# EAGLE design CommsTestBoard (EAGLE 9.6.2)
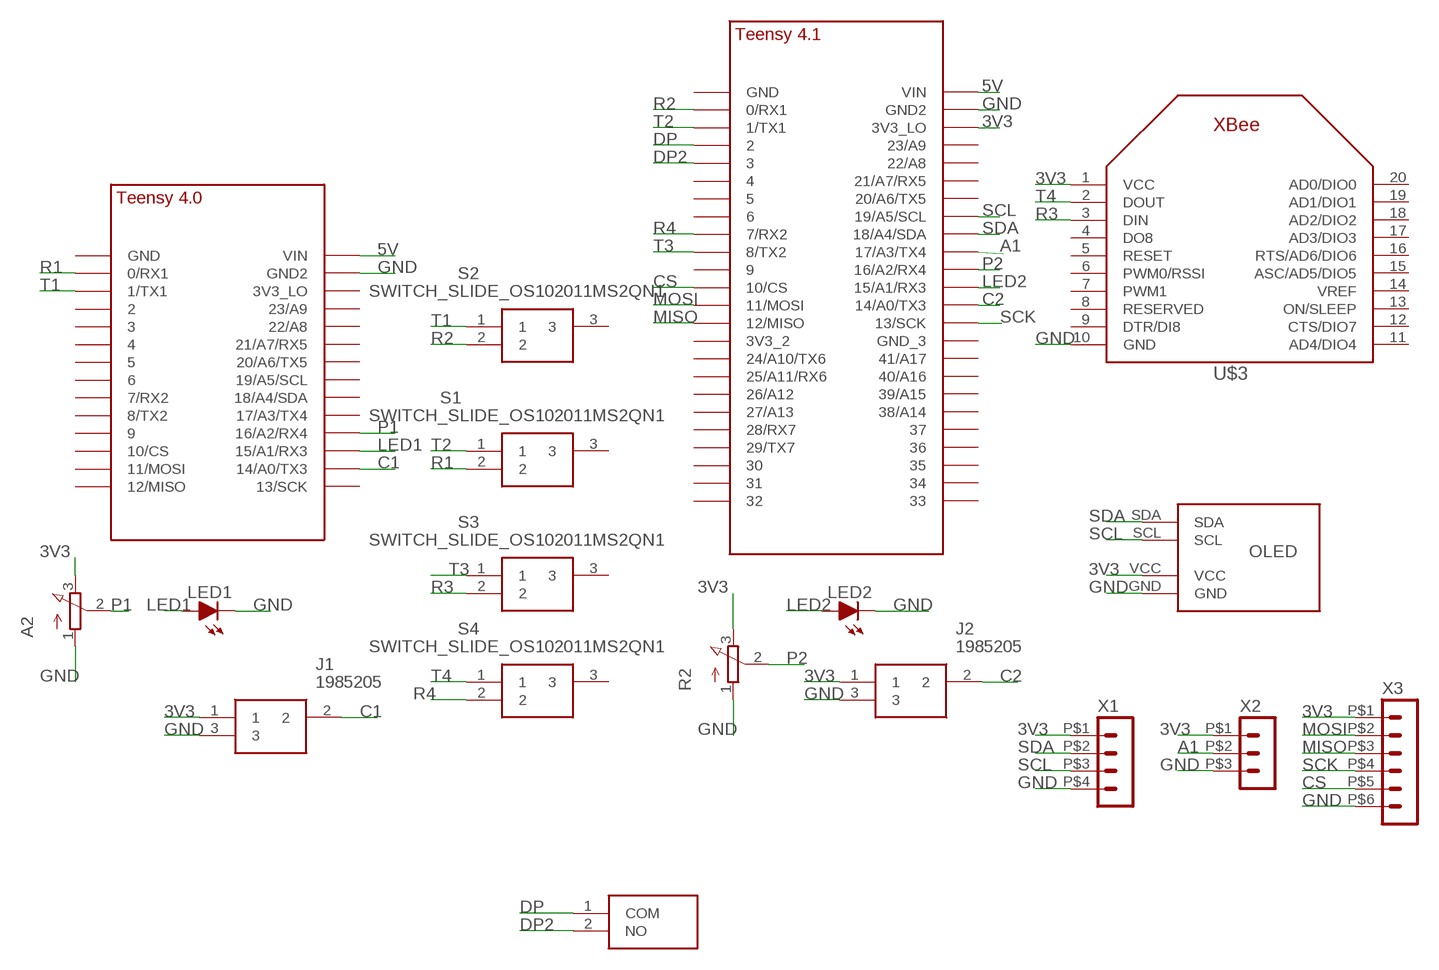
[diagram p0: schematic, sheet 1]

## Parts
A2  POTENTIOMETER  [3RP/1610N]
J1  1985205  [1985205]
J2  1985205  [1985205]
LED1  LED-5MM  [LED-5MM]
LED2  LED-5MM  [LED-5MM]
R2  POTENTIOMETER  [3RP/1610N]
S1  SWITCH_SLIDE_OS102011MS2QN1  [OS102011MA1QN1]
S2  SWITCH_SLIDE_OS102011MS2QN1  [OS102011MA1QN1]
S3  SWITCH_SLIDE_OS102011MS2QN1  [OS102011MA1QN1]
S4  SWITCH_SLIDE_OS102011MS2QN1  [OS102011MA1QN1]
S5  PTS636_SL50_LFS  [PTS636SL50LFS]
U$1  TEENSY_4.0_SIMPLE  [TEENSY_4.0_SIMPLE]
U$2  TEENSY_4.1_SIMPLE  [TEENSY_4.1_SIMPLE]
U$3  XBEE  [XBEE]
U$4  OLED_SSD1306  [OLED_SSD1306]
X1  HEADER_POS4_43045-0401  [43045-0400]
X2  HEADER_POS3_43650-0300  [43650-0300]
X3  HEADER_POS6_43045-0600  [43045-0600]

## Nets
3V3: A2.3(E) J1.1 J2.1 R2.3(E) U$2.3V3_LO U$3.1(VCC) U$4.VCC X1.P$1 X2.P$1 X3.P$1
5V: U$1.VIN U$2.VIN
A1: U$2.17/A3(17/A3/TX4) X2.P$2
C1: J1.2 U$1.14/A0(14/A0/TX3)
C2: J2.2 U$2.14/A0(14/A0/TX3)
CS: U$2.10/CS X3.P$5
DP: S5.1(COM) U$2.2
DP2: S5.2(NO) U$2.3/CANTX
GND: A2.1(A) J1.3 J2.3 LED1.K(C) LED2.K(C) R2.1(A) U$1.GND2 U$2.GND2 U$3.10(GND) U$4.GND X1.P$4 X2.P$3 X3.P$6
LED1: LED1.A U$1.15/A1(15/A1/RX3)
LED2: LED2.A U$2.15/A1(15/A1/RX3)
MISO: U$2.12/MISO X3.P$3
MOSI: U$2.11/MOSI X3.P$2
P1: A2.2(S) U$1.16/A2(16/A2/RX4)
P2: R2.2(S) U$2.16/A2(16/A2/RX4)
R1: S1.2 U$1.0/RX(0/RX1)
R2: S2.2 U$2.0/RX(0/RX1)
R3: S3.2 U$3.3(DIN)
R4: S4.2 U$2.7(7/RX2)
SCK: U$2.13/SCK X3.P$4
SCL: U$2.19/A5/SCL U$4.SCL X1.P$3
SDA: U$2.18/A4/SDA U$4.SDA X1.P$2
T1: S2.1 U$1.1/TX(1/TX1)
T2: S1.1 U$2.1/TX(1/TX1)
T3: S3.1 U$2.8(8/TX2)
T4: S4.1 U$3.2(DOUT)
Unconnected: S1.3 S2.3 S3.3 S4.3 U$1.2 U$1.3/CANTX U$1.3V3_LO U$1.4/CANRX U$1.5 U$1.6 U$1.7(7/RX2) U$1.8(8/TX2) U$1.9/CS U$1.10/CS U$1.11/MOSI U$1.12/MISO U$1.13/SCK U$1.17/A3(17/A3/TX4) U$1.18/A4/SDA U$1.19/A5/SCL U$1.20/A6(20/A6/TX5) U$1.21/A7(21/A7/RX5) U$1.22/A8 U$1.23/A9 U$1.GND U$2.3V3_2 U$2.4/CANRX U$2.5 U$2.6 U$2.9/CS U$2.20/A6(20/A6/TX5) U$2.21/A7(21/A7/RX5) U$2.22/A8 U$2.23/A9 U$2.24/A10(24/A10/TX6) U$2.25/A11(25/A11/RX6) U$2.26/A12 U$2.27/A13 U$2.28(28/RX7) U$2.29(29/TX7) U$2.30 U$2.31 U$2.32 U$2.33 U$2.34 U$2.35 U$2.36 U$2.37 U$2.38/A14 U$2.39/A15 U$2.40/A16 U$2.41/A17 U$2.GND U$2.GND3(GND_3) U$3.4(DO8) U$3.5(RESET) U$3.6(PWM0/RSSI) U$3.7(PWM1) U$3.8(RESERVED) U$3.9(DTR/DI8) U$3.11(AD4/DIO4) U$3.12(CTS/DIO7) U$3.13(ON/SLEEP) U$3.14(VREF) U$3.15(ASC/AD5/DIO5) U$3.16(RTS/AD6/DIO6) U$3.17(AD3/DIO3) U$3.18(AD2/DIO2) U$3.19(AD1/DIO1) U$3.20(AD0/DIO0)

## Library data of the parts
A2 R2 = GTOR - Passive Components:POTENTIOMETER: 16mm Potentiometer one level Source: http://www.alphapotentiometers.net/html/16mm_pot_2.html
J1 J2 = GTOR - Connectors:1985205: Fixed Terminal Blocks PTSA 1.5/3-3.5-Z Source: Datasheet <https://componentsearchengine.com/Datasheets/1/1985205.pdf>; ARROW_PART_NUMBER: 1985205; ARROW_PRICE-STOCK: https://www.arrow.com/en/products/1985205/phoenix-contact; DESCRIPTION: Fixed Terminal Blocks PTSA 1.5/3-3.5-Z; HEIGHT: 13mm; MANUFACTURER_NAME: Phoenix Contact; MANUFACTURER_PART_NUMBER: 1985205; MOUSER_PART_NUMBER: 651-1985205; MOUSER_PRICE-STOCK: https://www.mouser.co.uk/ProductDetail/Phoenix-Contact/1985205?qs=JcjeNNoqGSNoFnucoMlHJQ%3D%3D
LED1 LED2 = GTOR - Passive Components:LED: Light Emitting Diode (LED) Source: Dangerous Prototypes Eagle Library <https://github.com/DangerousPrototypes/Eagle_Part_Library>
S1-S4 = GTOR - Active Components:SWITCH_SLIDE_OS102011MS2QN1: Switch Slide Miniature SPDT 0.1A 12VDC Through Hole Slide Switch SPDT On-On 0.1 A@ 12 V dc Slide Source: Datasheet <http://www.ckswitches.com/media/1428/os.pdf>; ARROW_PART_NUMBER: OS102011MS2QN1; ARROW_PRICE-STOCK: https://www.arrow.com/en/products/os102011ms2qn1/ck; DESCRIPTION: Switch Slide Miniature SPDT 0.1A 12VDC Through Hole Slide Switch SPDT On-On 0.1 A@ 12 V dc Slide; HEIGHT: mm; MANUFACTURER_NAME: C & K COMPONENTS; MANUFACTURER_PART_NUMBER: OS102011MS2QN1; MOUSER_PART_NUMBER: 611-OS102011MS2QN1; MOUSER_PRICE-STOCK: https://www.mouser.co.uk/ProductDetail/CK/OS102011MS2QN1?qs=WtljUlYws5RvQ1hEv876nQ%3D%3D
S5 = GTOR - Active Components:PTS636_SL50_LFS: Tactile Switches Tact 50mA 12VDC, 6.0x3.5, 5.0mm H, 130gf, THT leads, Black Actuator Source: Datasheet <https://componentsearchengine.com/Datasheets/1/PTS636 SL50 LFS.pdf>; ARROW_PART_NUMBER: PTS636 SL50 LFS; ARROW_PRICE-STOCK: https://www.arrow.com/en/products/pts636-sl50-lfs/ck; DESCRIPTION: Tactile Switches Tact 50mA 12VDC, 6.0x3.5, 5.0mm H, 130gf, THT leads, Black Actuator; HEIGHT: 5.2mm; MANUFACTURER_NAME: C & K COMPONENTS; MANUFACTURER_PART_NUMBER: PTS636 SL50 LFS; MOUSER_PART_NUMBER: 611-PTS636SL50LFS; MOUSER_PRICE-STOCK: https://www.mouser.co.uk/ProductDetail/CK/PTS636-SL50-LFS?qs=vLWxofP3U2xbACAJDYC1Hw%3D%3D
U$1 = GTOR - Microcontroller:TEENSY_4.0_SIMPLE
U$2 = GTOR - Microcontroller:TEENSY_4.1_SIMPLE
U$3 = GTOR - Microcontroller:XBEE: Source: Adafruit <https://github.com/adafruit/Adafruit-Eagle-Library>
U$4 = GTOR - Breakout Boards:OLED_SSD1306
X1 = GTOR - Microfit Connector:HEADER_POS4_?: Molex - Micro-Fit 3.0 Series connector, 3.00mm (0.118") pitch header, 4 positions.
X2 = GTOR - Microfit Connector:HEADER_POS3_?: Molex - Micro-Fit 3.0 Series connector, 3.00mm (0.118") pitch header, 3 positions.
X3 = GTOR - Microfit Connector:HEADER_POS6_?: Molex - Micro-Fit 3.0 Series connector, 3.00mm (0.118") pitch header, 6 positions.

## Board
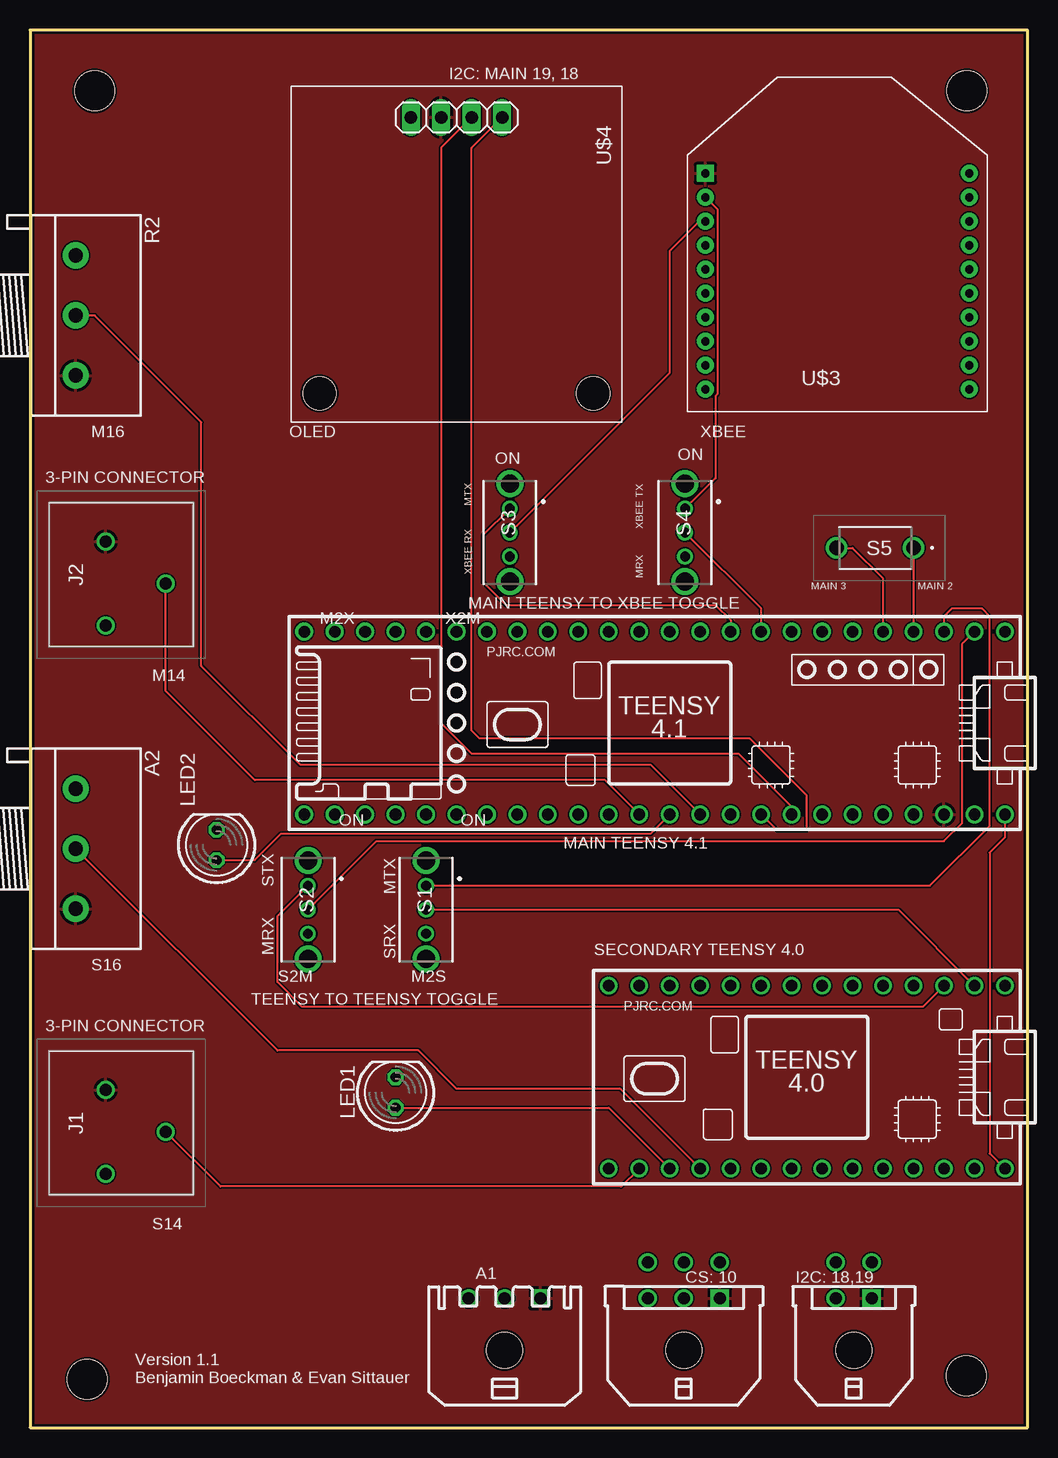
[diagram p1: board, top side]
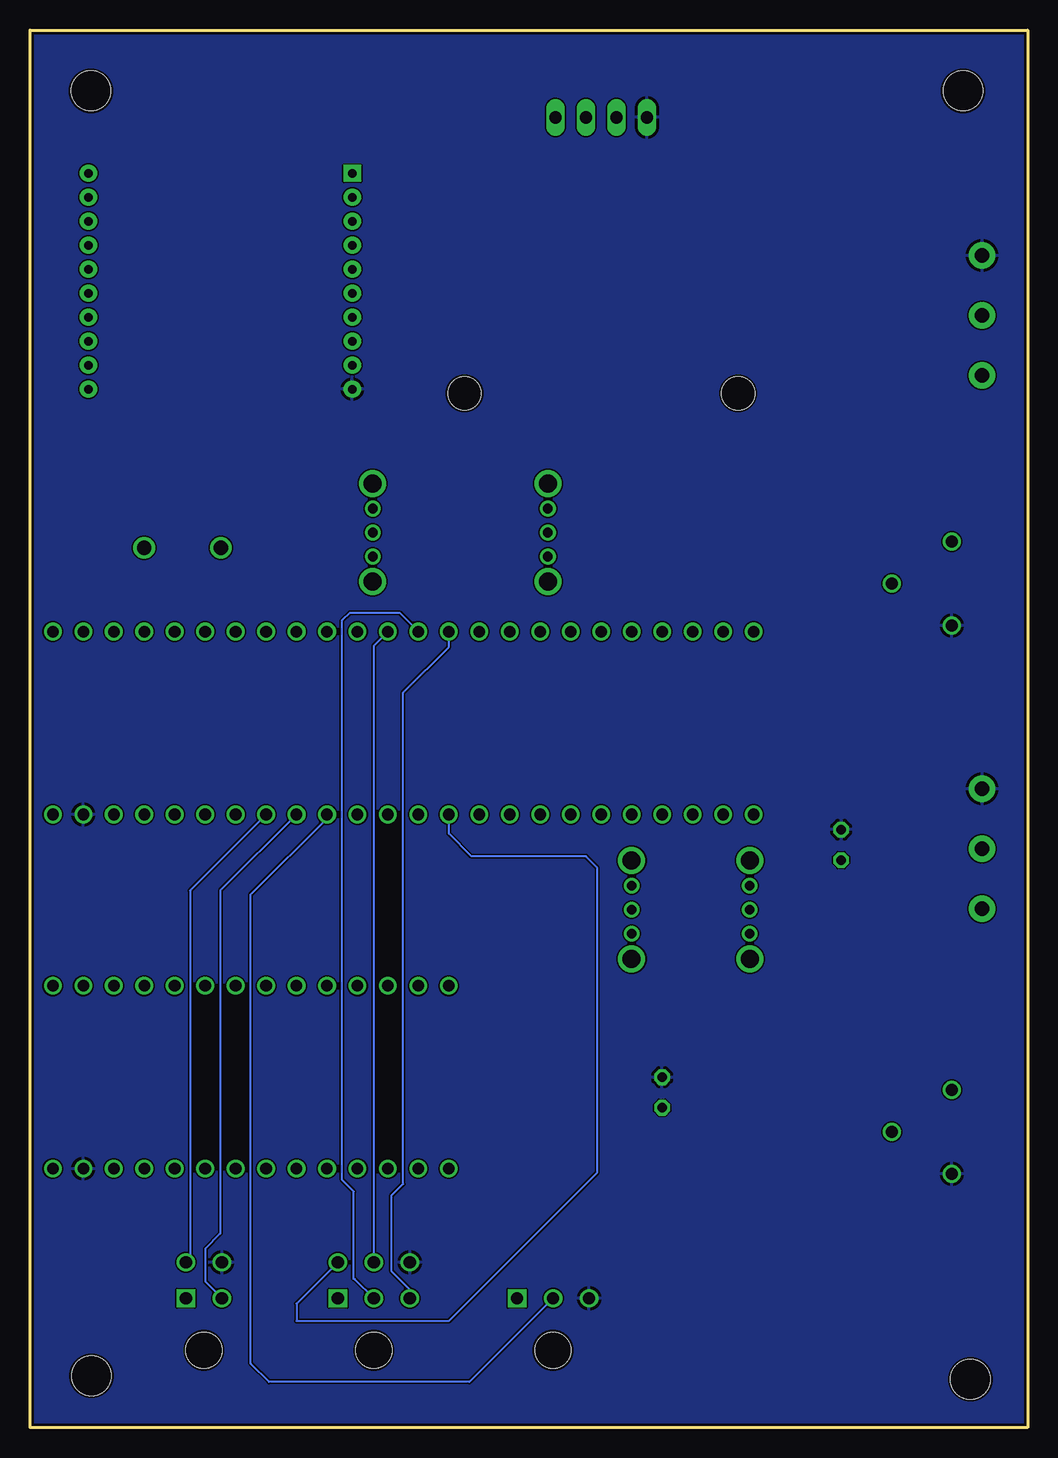
[diagram p2: board, bottom side, seen from below]

Size 83.18 x 116.51 mm. Coordinates in mm from the lower left corner, seen from the top.
Outline: 83.18,0 83.18,116.51 0,116.51 0,0 83.18,0
Copper layers (1*16): Top 0.035mm / dielectric 1.6mm / Bottom 0.035mm
Design rules "designrulecheck_jlcpcb_2layers": minimum track width 5mil, minimum drill 0.3mm, track to track 5mil, track to pad 0.2mm, pad to pad 5mil, via to via 10mil, smd to smd 5mil, copper to edge 0.2mm, drill to drill 0.5mm, minimum pad ring 10mil, minimum via ring 0.3mm, stop-mask expansion 4mil, vias tented up to drill 0mil, thermal gap 10mil
Holes 3.3 mm at 4.78,4.03 5.4,111.44 78.1,111.44 78.05,4.32
Holes 2.75 mm at 24.15,86.21 46.95,86.21

### Footprints (pad centres in the part's own frame; a part is rotated, then mirrored left to right if it is on the bottom)
3RP/1610N = drill 1.2 pad 2.184: 1 -5,0; 2 0,0; 3 5,0
1985205 = drill 1 pad 1.5: 1 -2.75,-1.3; 2 0.75,3.7; 3 4.25,-1.3
LED-5MM = drill 0.813 octagon: A -1.27,0; K 1.27,0
OS102011MA1QN1 = drill 0.8 pad 1.3: 1 -2,0; 2 0,0; 3 2,0 | drill 1.5 pad 2.25: 4 -4.1,0; 5 4.1,0
PTS636SL50LFS = drill 1.2 pad 1.8: 1 0,0; 2 6.4,0
TEENSY_4.0_SIMPLE = drill 0.965: 0/RX -13.97,-7.62; 1/TX -11.43,-7.62; 2 -8.89,-7.62; 3/CANTX -6.35,-7.62; 3V3_LO -11.43,7.62; 4/CANRX -3.81,-7.62; 5 -1.27,-7.62; 6 1.27,-7.62; 7 3.81,-7.62; 8 6.35,-7.62; 9/CS 8.89,-7.62; 10/CS 11.43,-7.62; 11/MOSI 13.97,-7.62; 12/MISO 16.51,-7.62; 13/SCK 16.51,7.62; 14/A0 13.97,7.62; 15/A1 11.43,7.62; 16/A2 8.89,7.62; 17/A3 6.35,7.62; 18/A4/SDA 3.81,7.62; 19/A5/SCL 1.27,7.62; 20/A6 -1.27,7.62; 21/A7 -3.81,7.62; 22/A8 -6.35,7.62; 23/A9 -8.89,7.62; GND -16.51,-7.62; GND2 -13.97,7.62; VIN -16.51,7.62
TEENSY_4.1_SIMPLE = drill 0.965: 0/RX -25.4,-7.62; 1/TX -22.86,-7.62; 2 -20.32,-7.62; 3/CANTX -17.78,-7.62; 3V3_2 7.62,-7.62; 3V3_LO -22.86,7.62; 4/CANRX -15.24,-7.62; 5 -12.7,-7.62; 6 -10.16,-7.62; 7 -7.62,-7.62; 8 -5.08,-7.62; 9/CS -2.54,-7.62; 10/CS 0,-7.62; 11/MOSI 2.54,-7.62; 12/MISO 5.08,-7.62; 13/SCK 5.08,7.62; 14/A0 2.54,7.62; 15/A1 0,7.62; 16/A2 -2.54,7.62; 17/A3 -5.08,7.62; 18/A4/SDA -7.62,7.62; 19/A5/SCL -10.16,7.62; 20/A6 -12.7,7.62; 21/A7 -15.24,7.62; 22/A8 -17.78,7.62; 23/A9 -20.32,7.62; 24/A10 10.16,-7.62; 25/A11 12.7,-7.62; 26/A12 15.24,-7.62; 27/A13 17.78,-7.62; 28 20.32,-7.62; 29 22.86,-7.62; 30 25.4,-7.62; 31 27.94,-7.62; 32 30.48,-7.62; 33 30.48,7.62; 34 27.94,7.62; 35 25.4,7.62; 36 22.86,7.62; 37 20.32,7.62; 38/A14 17.78,7.62; 39/A15 15.24,7.62; 40/A16 12.7,7.62; 41/A17 10.16,7.62; GND -27.94,-7.62; GND2 -25.4,7.62; GND3 7.62,7.62; VIN -27.94,7.62
XBEE = drill 0.7 pad 1.422 square: 1 -11,5.5 | drill 0.7 pad 1.422: 2 -11,3.5; 3 -11,1.5; 4 -11,-0.5; 5 -11,-2.5; 6 -11,-4.5; 7 -11,-6.5; 8 -11,-8.5; 9 -11,-10.5; 10 -11,-12.5; 11 11,-12.5; 12 11,-10.5; 13 11,-8.5; 14 11,-6.5; 15 11,-4.5; 16 11,-2.5; 17 11,-0.5; 18 11,1.5; 19 11,3.5; 20 11,5.5
OLED_SSD1306 = drill 1.016 long: GND 0,-3.81; SCL 0,1.27; SDA 0,3.81; VCC 0,-1.27
43045-0400 = drill 1.02 square: P$1 1.5,4.32 | drill 1.02: P$2 -1.5,4.32; P$3 1.5,7.32; P$4 -1.5,7.32 | hole 3: 0,0
43650-0300 = drill 1.02 square: P$1 3,4.32 | drill 1.02: P$2 0,4.32; P$3 -3,4.32 | hole 3: 0,0
43045-0600 = drill 1.02 square: P$1 3,4.32 | drill 1.02: P$2 0,4.32; P$3 -3,4.32; P$4 3,7.32; P$5 0,7.32; P$6 -3,7.32 | hole 3: 0,0

### Placement (x,y rotation side)
A2  3.81,48.26 270 top
J1  7.62,25.4 270 top
J2  7.62,71.12 270 top
LED1  30.48,27.94 90 top
LED2  15.56,48.58 90 top
R2  3.81,92.71 270 top
S1  33.02,43.18 270 top
S2  23.18,43.18 270 top
S3  40.01,74.61 270 top
S4  54.61,74.61 270 top
S5  73.66,73.34 180 top
U$1  64.77,29.21 180 top
U$2  53.34,58.74 180 top
U$3  67.31,99.06 0 top
U$4  35.56,109.22 270 top
X1  68.68,6.46 0 top
X2  39.57,6.46 0 top
X3  54.51,6.46 0 top

### Tracks (layer width: path | path; a pad name or v marks a point on that pad's centre or on a via)
3V3
  pour Top: 0,116.52 83.18,116.52 83.18,0 0,0
5V
  Top 0.152: U$2.VIN 81.28,49.21 80.01,47.94 80.01,22.86 U$1.VIN
A1
  Bottom 0.152: X2.P$2 46.54,3.81 63.26,3.81 64.77,5.32 64.77,44.45 58.42,50.8 U$2.17/A3
C1
  Top 0.152: J1.2 15.88,20.1 49.3,20.1 U$1.14/A0
C2
  Top 0.152: U$2.14/A0 47.94,53.98 18.73,53.98 11.32,61.39 J2.2
CS
  Bottom 0.152: X3.P$5 54.51,65.19 U$2.10/CS
DP
  Top 0.152: S5.1 U$2.2
DP2
  Top 0.152: S5.2 68.58,73.34 71.12,70.8 U$2.3/CANTX
GND
  pour Bottom: 0,0 83.18,0 83.18,116.84 0,116.84
LED1
  Top 0.152: LED1.A 48.26,26.67 U$1.15/A1
LED2
  Top 0.152: LED2.A 18.73,47.31 20.95,49.53 51.75,49.53 U$2.15/A1
MISO
  Bottom 0.152: X3.P$3 51.51,11.51 53.02,13.02 53.02,19.37 52.07,20.32 52.07,61.28 48.26,65.09 U$2.12/MISO
MOSI
  Bottom 0.152: X3.P$2 56.11,12.38 56.2,12.38 56.2,19.69 57.15,20.64 57.15,67.31 56.52,67.95 52.39,67.95 U$2.11/MOSI
P1
  Top 0.152: U$1.16/A2 49.21,28.26 35.56,28.26 32.38,31.43 20.64,31.43 A2.2
P2
  Top 0.152: U$2.16/A2 51.75,55.25 22.54,55.25 14.29,63.5 14.29,83.82 5.4,92.71 R2.2
R1
  Top 0.152: S1.2 72.39,43.18 U$1.0/RX
R2
  Top 0.152: S2.2 28.89,48.89 76.2,48.89 77.73,50.42 77.73,65.34 U$2.0/RX
R3
  Top 0.152: S3.2 53.34,87.95 53.34,98.11 55.79,100.56 U$3.3
R4
  Top 0.152: U$2.7 60.96,68.26 S4.2
SCK
  Bottom 0.152: X3.P$4 60.96,10.33 60.96,8.89 48.26,8.89 35.88,21.27 35.88,46.67 36.83,47.62 46.36,47.62 48.26,49.53 U$2.13/SCK
SCL
  Top 0.152: U$4.SCL 34.29,106.68 34.29,58.74 36.83,56.2 59.05,56.2 63.5,51.75 U$2.19/A5/SCL
  Bottom 0.152: U$2.19/A5/SCL 69.85,44.77 69.85,14.11 X1.P$3
SDA
  Top 0.152: U$2.18/A4/SDA 62.27,49.81 64.77,49.81 64.77,52.7 60.01,57.47 37.46,57.47 36.83,58.1 36.83,106.68 U$4.SDA
  Bottom 0.152: U$2.18/A4/SDA 67.31,44.77 67.31,16.19 68.58,14.92 68.58,12.18 X1.P$2
T1
  Top 0.152: U$1.1/TX 74.45,35.08 73.98,35.08 22.7,35.08 20.64,37.15 20.64,42.64 20.75,42.75 S2.1
T2
  Top 0.152: S1.1 64.45,45.18 64.55,45.18 75.02,45.18 80.01,50.17 80.01,67.63 79.38,68.26 76.83,68.26 76.2,67.63 U$2.1/TX
T3
  Top 0.152: S3.1 37.78,74.39 37.78,70.48 39.69,68.58 57.15,68.58 58.42,67.31 U$2.8
T4
  Top 0.152: U$3.2 57.3,101.57 57.3,86.15 57.15,86 57.15,79.15 S4.1

### Text on the board
tPlace: I2C: MAIN 19, 18 | M16 | OLED | XBEE | ON | ON | 3-PIN CONNECTOR | MTX | XBEE TX | XBEE RX | MRX | MAIN 3 | MAIN 2 | MAIN TEENSY TO XBEE TOGGLE | M2X | X2M | M14 | ON | ON | MAIN TEENSY 4.1 | STX | MTX | MRX | SRX | SECONDARY TEENSY 4.0 | S16 | S2M | M2S | TEENSY TO TEENSY TOGGLE | 3-PIN CONNECTOR | S14 | A1 | CS: 10 | I2C: 18,19 | Version 1.1 / Benjamin Boeckman & Evan Sittauer